# EAGLE design usbtomidi (EAGLE 7.5.0)
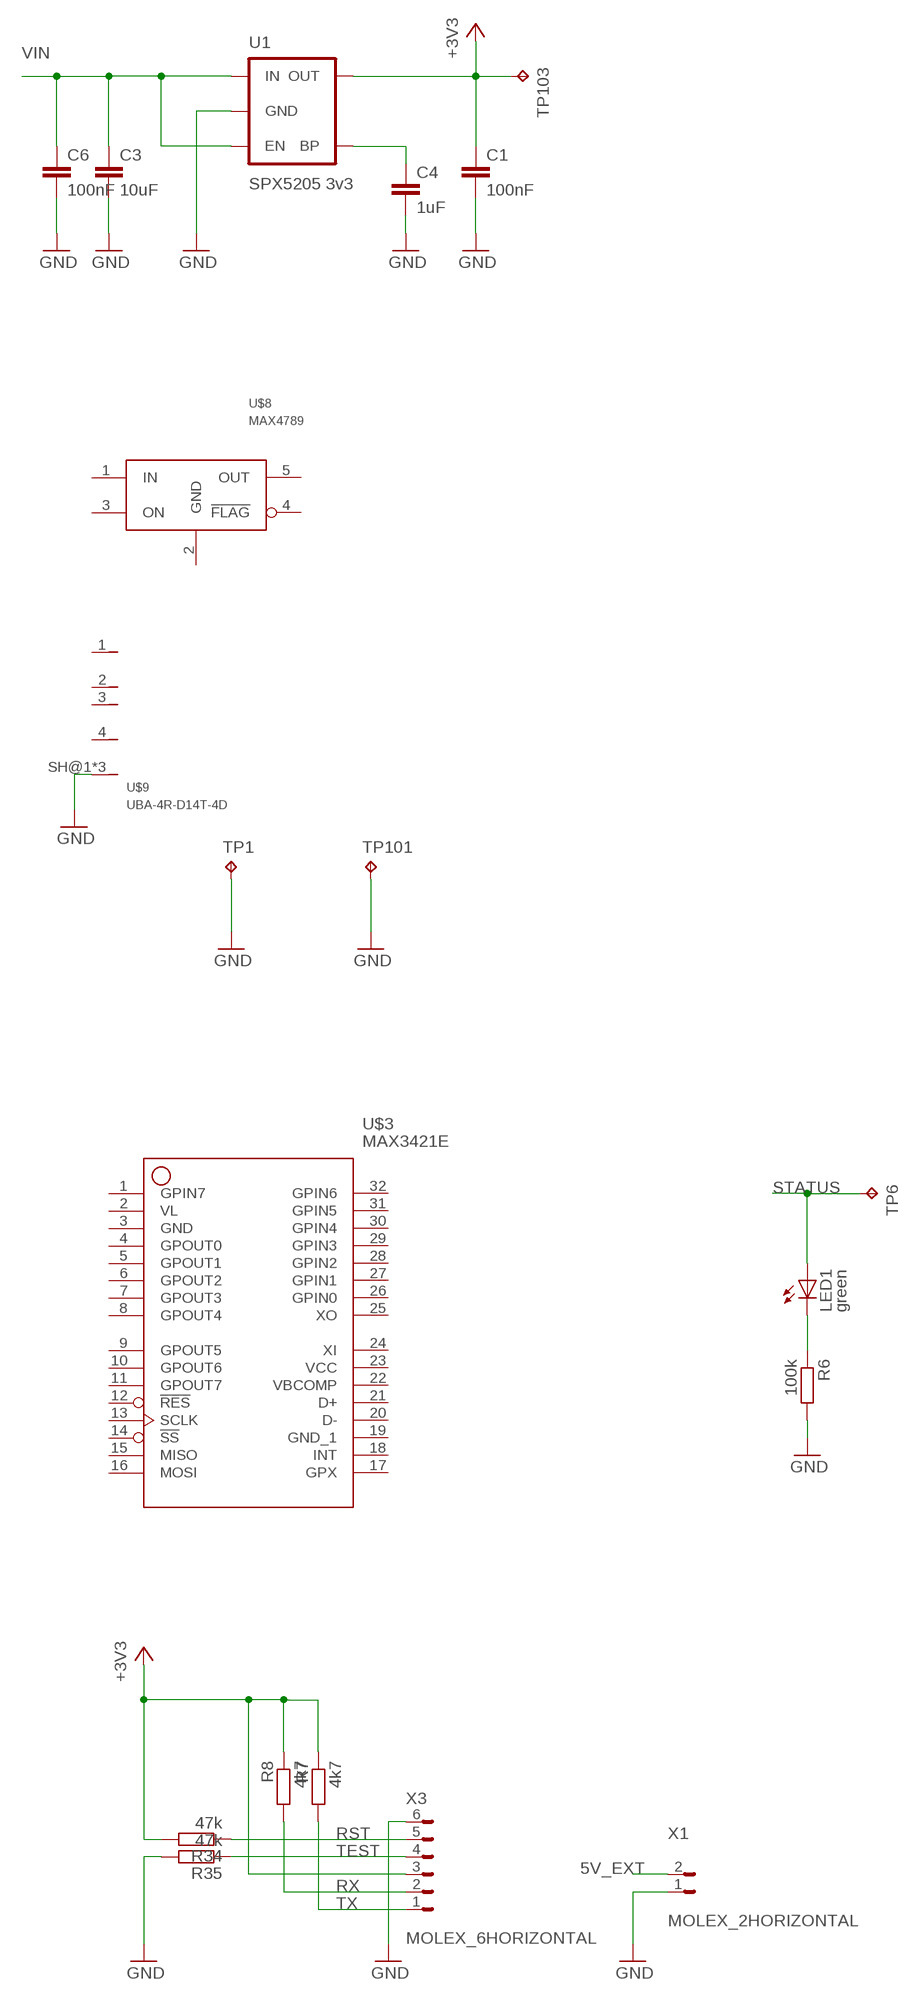
[diagram p0: schematic, sheet 1, part 1 of 2]
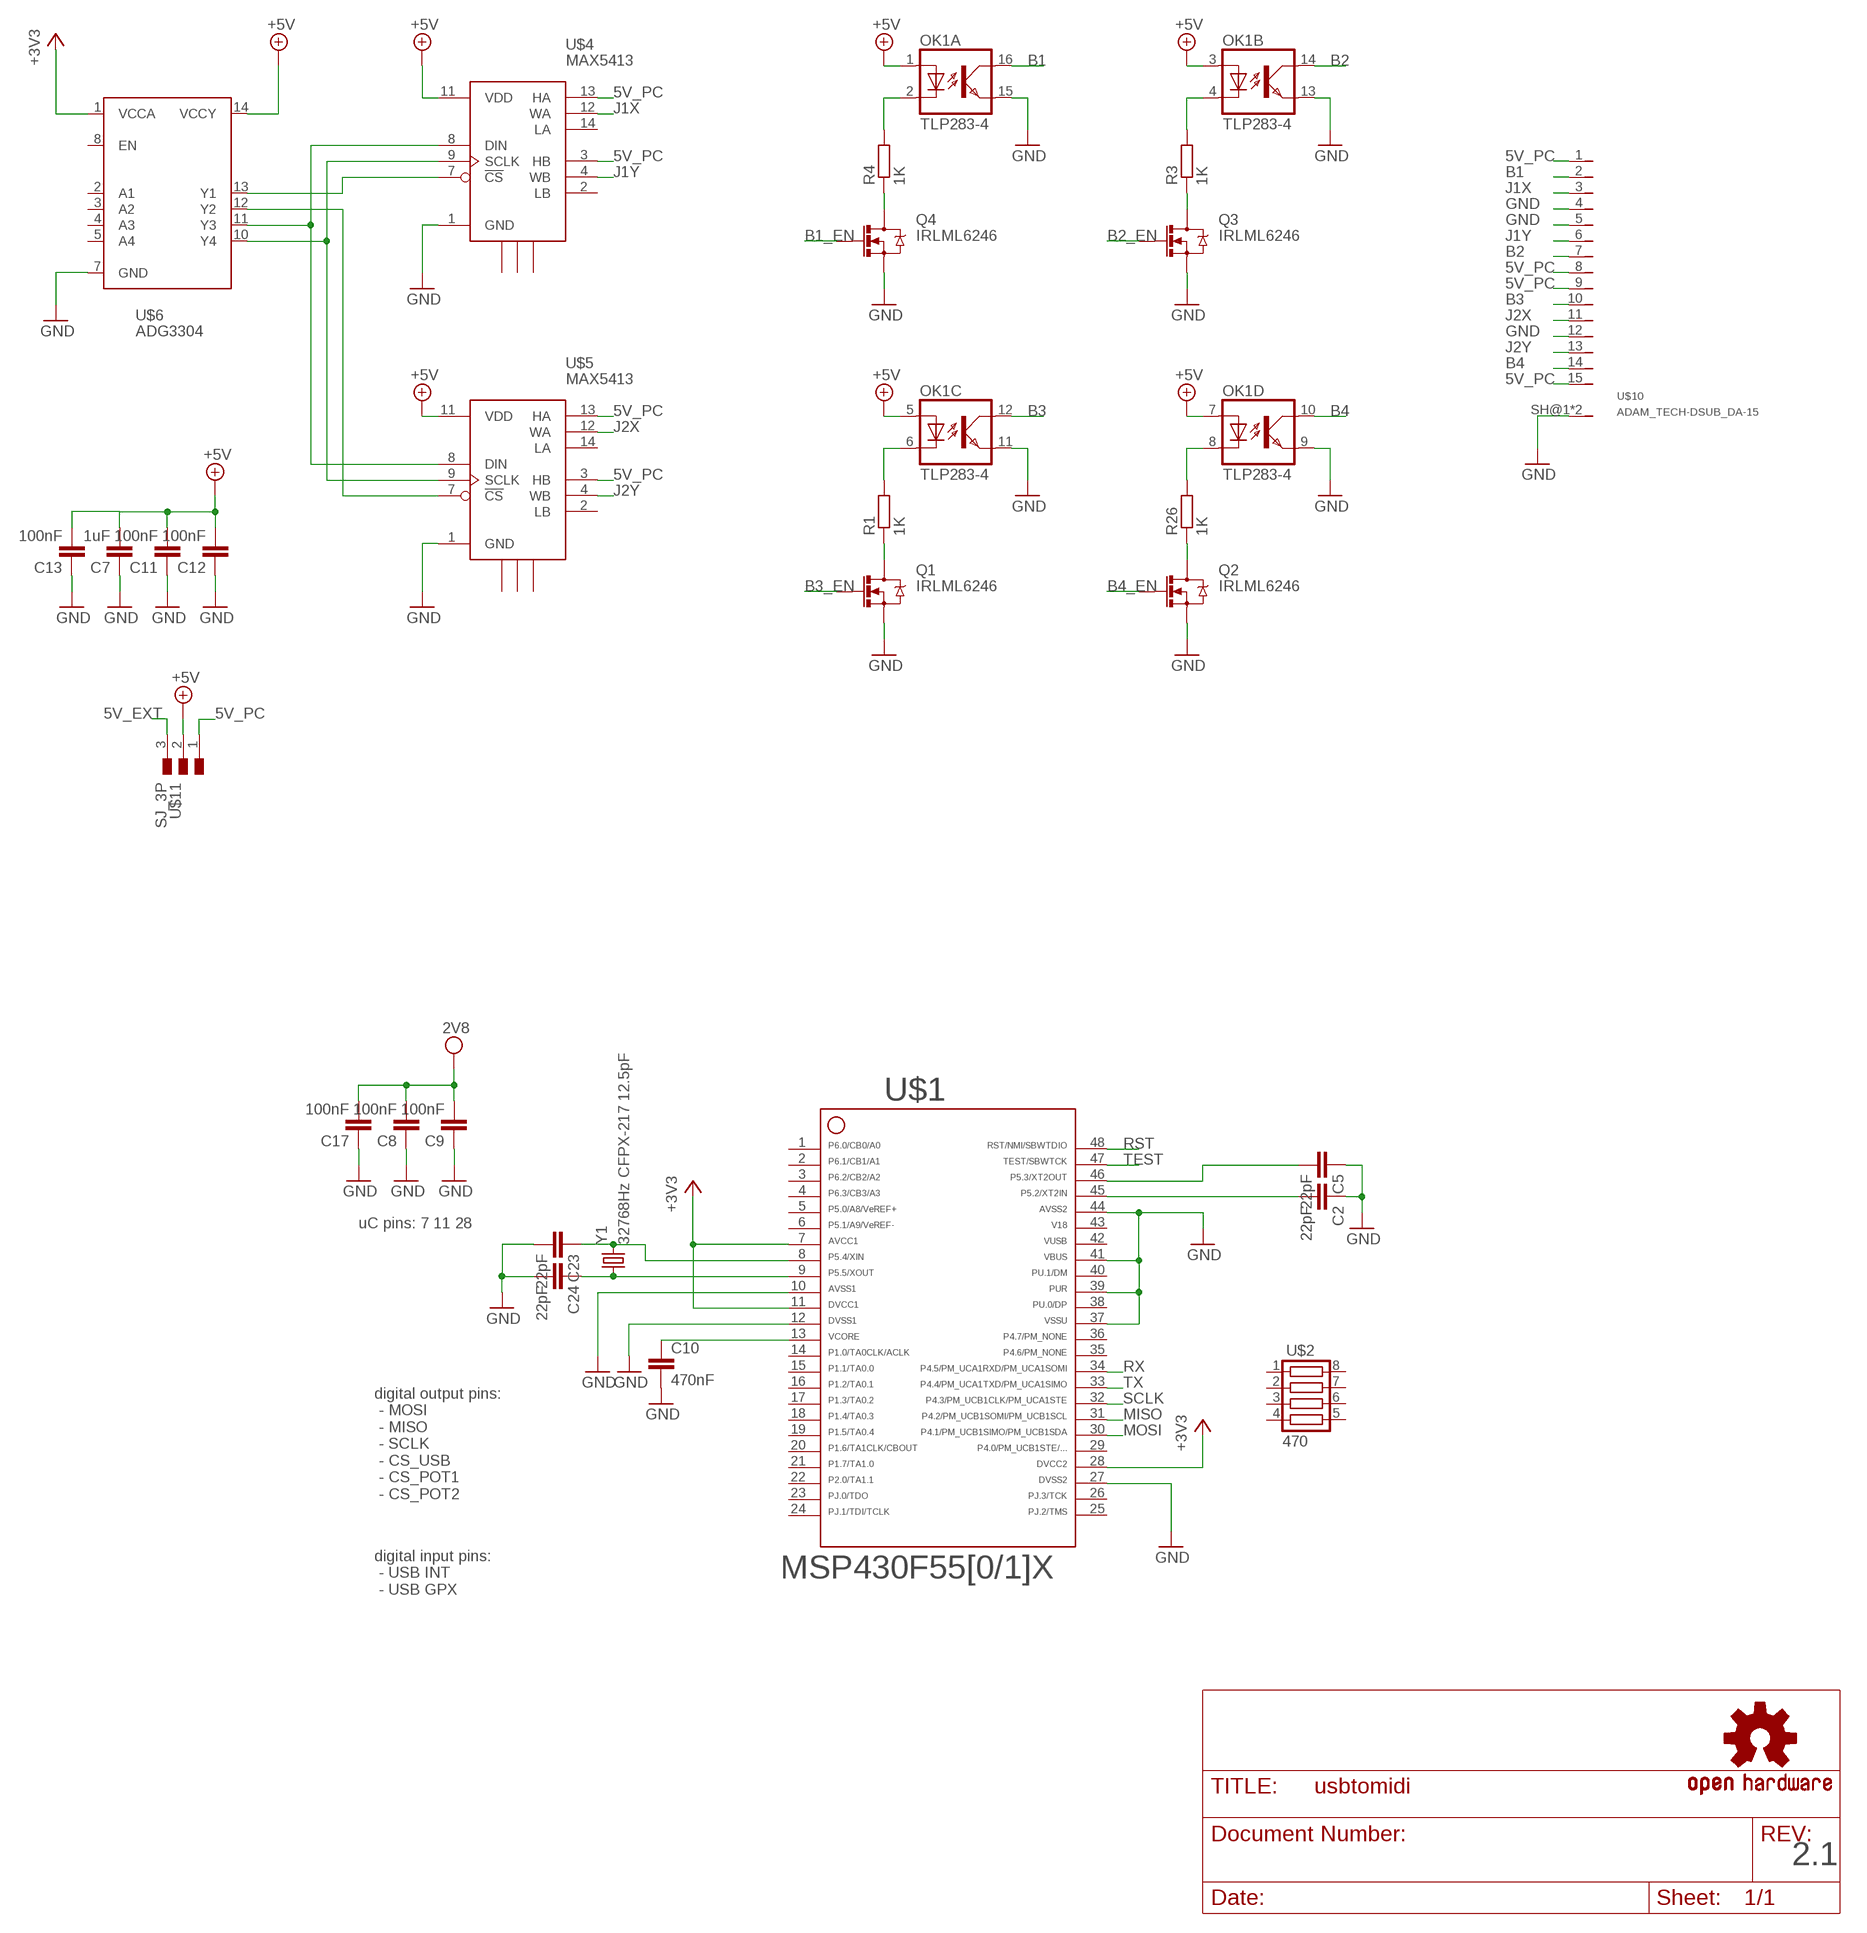
[diagram p1: schematic, sheet 1, part 2 of 2]

## Parts
C1  100nF  C-EUC0805  [C0805]
C2  22pF  C-EUC0805  [C0805]
C3  10uF  C-EUC0805  [C0805]
C4  1uF  C-EUC0805  [C0805]
C5  22pF  C-EUC0805  [C0805]
C6  100nF  C-EUC0805  [C0805]
C7  1uF  C-EUC0805  [C0805]
C8  100nF  C-EUC0805  [C0805]
C9  100nF  C-EUC0805  [C0805]
C10  470nF  C-EUC0805  [C0805]
C11  100nF  C-EUC0805  [C0805]
C12  100nF  C-EUC0805  [C0805]
C13  100nF  C-EUC0805  [C0805]
C17  100nF  C-EUC0805  [C0805]
C23  22pF  C-EUC0805  [C0805]
C24  22pF  C-EUC0805  [C0805]
LED1  green  LEDCHIPLED_0805  [CHIPLED_0805]
OK1  TLP283-4  [MINI-FLAT-16]
Q1  IRLML6246  MOSFET-NCHANNEL_SOT23-3  [SOT23-3]
Q2  IRLML6246  MOSFET-NCHANNEL_SOT23-3  [SOT23-3]
Q3  IRLML6246  MOSFET-NCHANNEL_SOT23-3  [SOT23-3]
Q4  IRLML6246  MOSFET-NCHANNEL_SOT23-3  [SOT23-3]
R1  1K  R-EU_R0805W  [R0805W]
R3  1K  R-EU_R0805W  [R0805W]
R4  1K  R-EU_R0805W  [R0805W]
R6  100k  R-EU_R0805W  [R0805W]
R7  4k7  R-EU_R0805W  [R0805W]
R8  4k7  R-EU_R0805W  [R0805W]
R26  1K  R-EU_R0805W  [R0805W]
R34  47k  R-EU_R0805W  [R0805W]
R35  47k  R-EU_R0805W  [R0805W]
TP1  TPTP12R  [TP12R]
TP6  TPTP12R  [TP12R]
TP101  TPTP12R  [TP12R]
TP103  TPTP12R  [TP12R]
U1  SPX5205 3v3  V_REG_LDOSMD  [SOT23-5]
U$1  MSP430F5510  F55[0/1]X---PT48  [PT48]
U$2  470  RES_ARR  [YC164]
U$3  MAX3421E  [TQFP32]
U$4  MAX5413  [TSSOP14]
U$5  MAX5413  [TSSOP14]
U$6  ADG3304  [TSSOP14]
U$7  OSHW-LOGOM  [OSHW-LOGO-M]
U$8  MAX4789  [SOT23-5]
U$9  UBA-4R-D14T-4D  [UBA-4R-D14T-4D]
U$10  ADAM_TECH-DSUB_DA-15  [ADAM_TECH_D-SUB_15]
U$11  SJ_3P  [SJ_3P]
X1  MOLEX_2HORIZONTAL  [0530480210]
X3  MOLEX_6HORIZONTAL  [0530480610]
Y1  32768Hz CFPX-217 12.5pF  CRYSTAL3.2X1.5  [CRYSTAL-SMD-3.2X1.5]

## Nets
2V8: C8.2 C9.2 C17.2
5V_EXT: U$11.3 X1.2
5V_PC: U$4.3(HB) U$4.13(HA) U$5.3(HB) U$5.13(HA) U$10.1 U$10.8 U$10.9 U$10.15 U$11.1
+3V3: C1.1 R7.1 R8.1 R34.2 TP103.TP U1.5(OUT) U$1.7 U$1.11 U$1.28 U$6.1(VCCA) X3.3
+5V: C7.2 C11.2 C12.2 C13.2 OK1.1(A:A) OK1.3(B:A) OK1.5(C:A) OK1.7(D:A) U$4.11(VDD) U$5.11(VDD) U$6.14(VCCY) U$11.2
B1: OK1.16(A:COL) U$10.2
B1_EN: Q4.1(G)
B2: OK1.14(B:COL) U$10.7
B2_EN: Q3.1(G)
B3: OK1.12(C:COL) U$10.10
B3_EN: Q1.1(G)
B4: OK1.10(D:COL) U$10.14
B4_EN: Q2.1(G)
GND: C1.2 C2.1 C3.2 C4.2 C5.1 C6.2 C7.1 C8.1 C9.1 C10.2 C11.1 C12.1 C13.1 C17.1 C23.2 C24.2 OK1.9(D:EMIT) OK1.11(C:EMIT) OK1.13(B:EMIT) OK1.15(A:EMIT) Q1.2(S) Q2.2(S) Q3.2(S) Q4.2(S) R6.2 R35.2 TP1.TP TP101.TP U1.2(GND) U$1.10 U$1.12 U$1.27 U$1.37 U$1.39 U$1.41 U$1.44 U$4.1(GND) U$5.1(GND) U$6.7(GND) U$9.SH@1(SH) U$9.SH@2(SH) U$9.SH@3(SH) U$10.4 U$10.5 U$10.12 U$10.SH@1(SHIELD) U$10.SH@2(SHIELD) X1.1 X3.6
HIGH_CS1: U$4.7(!CS) U$6.13(Y1)
HIGH_CS2: U$5.7(!CS) U$6.12(Y2)
HIGH_MOSI: U$4.8(DIN) U$5.8(DIN) U$6.11(Y3)
HIGH_SCLK: U$4.9(SCLK) U$5.9(SCLK) U$6.10(Y4)
J1X: U$4.12(WA) U$10.3
J1Y: U$4.4(WB) U$10.6
J2X: U$5.12(WA) U$10.11
J2Y: U$5.4(WB) U$10.13
MISO: U$1.31
MOSI: U$1.30
N$1: C2.2 U$1.45
N$2: C4.1 U1.4(BP)
N$3: C5.2 U$1.46
N$5: Q1.3(D) R1.1
N$6: C10.1 U$1.13
N$7: OK1.6(C:C) R1.2
N$8: LED1.C R6.1
N$9: OK1.8(D:C) R26.2
N$12: Q3.3(D) R3.1
N$13: OK1.4(B:C) R3.2
N$14: Q4.3(D) R4.1
N$15: OK1.2(A:C) R4.2
N$22: Q2.3(D) R26.1
N$25: C24.1 U$1.9 Y1.P$1
N$26: C23.1 U$1.8 Y1.P$2
RST: R34.1 U$1.48 X3.5
RX: R8.2 U$1.34 X3.2
SCLK: U$1.32
STATUS: LED1.A TP6.TP
TEST: R35.1 U$1.47 X3.4
TX: R7.2 U$1.33 X3.1
VIN: C3.1 C6.1 U1.1(IN) U1.3(EN)
Unconnected: U$1.1 U$1.2 U$1.3 U$1.4 U$1.5 U$1.6 U$1.14 U$1.15 U$1.16 U$1.17 U$1.18 U$1.19 U$1.20 U$1.21 U$1.22 U$1.23 U$1.24 U$1.25 U$1.26 U$1.29 U$1.35 U$1.36 U$1.38 U$1.40 U$2.1 U$2.2 U$2.3 U$2.4 U$2.5 U$2.6 U$2.7 U$2.8 U$3.1(GPIN7) U$3.2(VL) U$3.3(GND) U$3.4(GPOUT0) U$3.5(GPOUT1) U$3.6(GPOUT2) U$3.7(GPOUT3) U$3.8(GPOUT4) U$3.9(GPOUT5) U$3.10(GPOUT6) U$3.11(GPOUT7) U$3.12(!RES) U$3.13(SCLK) U$3.14(!SS) U$3.15(MISO) U$3.16(MOSI) U$3.17(GPX) U$3.18(INT) U$3.19(GND_1) U$3.20(D-) U$3.21(D+) U$3.22(VBCOMP) U$3.23(VCC) U$3.24(XI) U$3.25(XO) U$3.26(GPIN0) U$3.27(GPIN1) U$3.28(GPIN2) U$3.29(GPIN3) U$3.30(GPIN4) U$3.31(GPIN5) U$3.32(GPIN6) U$4.2(LB) U$4.5(NC1) U$4.6(NC2) U$4.10(NC3) U$4.14(LA) U$5.2(LB) U$5.5(NC1) U$5.6(NC2) U$5.10(NC3) U$5.14(LA) U$6.2(A1) U$6.3(A2) U$6.4(A3) U$6.5(A4) U$6.8(EN) U$8.2(GND) U$8.3(ON) U$8.4(!FLAG) U$9.1 U$9.2 U$9.3 U$9.4

## Notes on the sheet
- uC pins: 7 11 28
- digital output pins: 
   - MOSI
   - MISO
   - SCLK
   - CS_USB
   - CS_POT1
   - CS_POT2
- digital input pins:
   - USB INT
   - USB GPX
- 2.1

## Power pins joined to a net without a drawn wire
42: U$1.42
43: U$1.43
IN: U$8.1(IN)
OUT: U$8.5(OUT)

## Library data of the parts
C1-C13 C17 C23 C24 = rcl:C-EU: CAPACITOR, European symbol
LED1 = led:LED: LED OSRAM: - CHIPLED LG R971, LG N971, LY N971, LG Q971, LY Q971, LO R971, LY R971 LH N974, LH R974 LS Q976, LO Q976, LY Q976 LO Q996 - Hyper CHIPLED LW Q18S LB Q993, LB Q99A, LB R99A - SideLED LS A670, LO A670, LY A670, LG A670, LP A670 LB A673, LV A673, LT A673, LW A673 LH A674 LY A675 LS A676, LA A676, LO A676, LY A676, LW A676 LS A679, LY A679, LG A679 - Hyper Micro SIDELED® LS Y876, LA Y876, LO Y876, LY Y876 LT Y87S - SmartLED LW L88C, LW L88S LB L89C, LB L89S, LG L890 LS L89K, LO L89K, LY L89K LS L896, LA L896, LO L896, LY L896 - TOPLED LS T670, LO T670, LY T670, LG T670, LP T670 LSG T670, LSP T670, LSY T670, LOP T670, LYG T670 LG T671, LOG T671, LSG T671 LB T673, LV T673, LT T673, LW T673 LH T674 LS T676, LA T676, LO T676, LY T676, LB T676, LH T676, LSB T676, LW T676 LB T67C, LV T67C, LT T67C, LS T67K, LO T67K, LY T67K, LW E67C LS E67B, LA E67B, LO E67B, LY E67B, LB E67C, LV E67C, LT E67C LW T67C LS T679, LY T679, LG T679 LS T770, LO T770, LY T770, LG T770, LP T770 LB T773, LV T773, LT T773, LW T773 LH T774 LS E675, LA E675, LY E675, LS T675 LS T776, LA T776, LO T776, LY T776, LB T776 LHGB T686 LT T68C, LB T68C - Hyper Mini TOPLED® LB M676 - Mini TOPLED Santana® LG M470 LS M47K, LO M47K, LY M47K Source: http://www.osram.convergy.de LUXEON: - LUMILED® LXK2-PW12-R00, LXK2-PW12-S00, LXK2-PW14-U00, LXK2-PW14-V00 LXK2-PM12-R00, LXK2-PM12-S00, LXK2-PM14-U00 LXK2-PE12-Q00, LXK2-PE12-R00, LXK2-PE12-S00, LXK2-PE14-T00, LXK2-PE14-U00 LXK2-PB12-K00, LXK2-PB12-L00, LXK2-PB12-M00, LXK2-PB14-N00, LXK2-PB14-P00, LXK2-PB14-Q00 LXK2-PR12-L00, LXK2-PR12-M00, LXK2-PR14-Q00, LXK2-PR14-R00 LXK2-PD12-Q00, LXK2-PD12-R00, LXK2-PD12-S00 LXK2-PH12-R00, LXK2-PH12-S00 LXK2-PL12-P00, LXK2-PL12-Q00, LXK2-PL12-R00 Source: www.luxeon.com KINGBRIGHT: KA-3528ASYC Source: www.kingbright.com
OK1 = optocoupler:TLP283-4: TOSHIBA PHOTOCOUPLER GaAs IRED & PHOTO-TRANSISTOR Source: http://www.semicon.toshiba.co.jp/td/en/Opto/Photocoupler/en_20050928_TLP283_datasheet.pdf; OC_FARNELL: unknown; OC_NEWARK: unknown
Q1-Q4 = Simplex-DiscreteSemi:MOSFET-NCHANNEL: Generic N-channel mosfet
R1 R3 R4 R6-R8 R26 R34 R35 = rcl:R-EU_: RESISTOR, European symbol
TP1 TP6 TP101 TP103 = testpad:TP: Test pad
U1 = SparkFun:V_REG_LDO: Voltage Regulator LDO Standard 150mA LDO voltage regulator in SOT-23 layout. Micrel part MIC5205. BP (by-pass) pin is used to lower output noise with 470pF cap.
U$1 = TI_MSP430_v16:F55[0/1]X---PT48: ***F55[0/1/2]X*** PT48 Rev. 1.0 06/2010 "http://www.ti.com/lit/gpn/msp430f5509" Only for FF5504, F5508,F5509,F5510
U$2 = Simplex-rlc:RES_ARR: resistor chip array yageo YC164 series (8pin/4R)
U$3 = Simplex-ICs:MAX3421E: MAX3421E USB Periperal/Host Controller
U$4 U$5 = Simplex-ICs:MAX5413: MAX5413 / MAX5414 / MAX 5415 dual digital potentiometers
U$6 = Simplex-ICs:ADG3304: ADG3304 4channel bi-directional voltage level translator
U$7 = SparkFun:OSHW-LOGO: Open Source Hardware Logo This logo indicates the piece of hardware it is found on incorporates a OSHW license and/or adheres to the definition of open source hardware found here: http://freedomdefined.org/OSHW
U$8 = Simplex-ICs:MAX4789: MAX4789 - MAX4794 current limit switch
U$9 = Simplex-Connectors:UBA-4R-D14T-4D: JST USB A
U$10 = Simplex-Connectors:ADAM_TECH-DSUB_DA-15: ADAM TECH D-SUB DA-15
U$11 = Simplex-Jumpers:SJ_3P: solder jumper 3 pin
X1 = Simplex-Connectors:MOLEX_2: Molex 2 pin connectors 1.25mm PicoBlade
X3 = Simplex-Connectors:MOLEX_6: Molex 6 pin connectors 1.25mm PicoBlade
Y1 = Simplex-FreqCtrl:CRYSTAL: smd crystals

## Net classes
1 vcc: width 0.203 mm

## Board
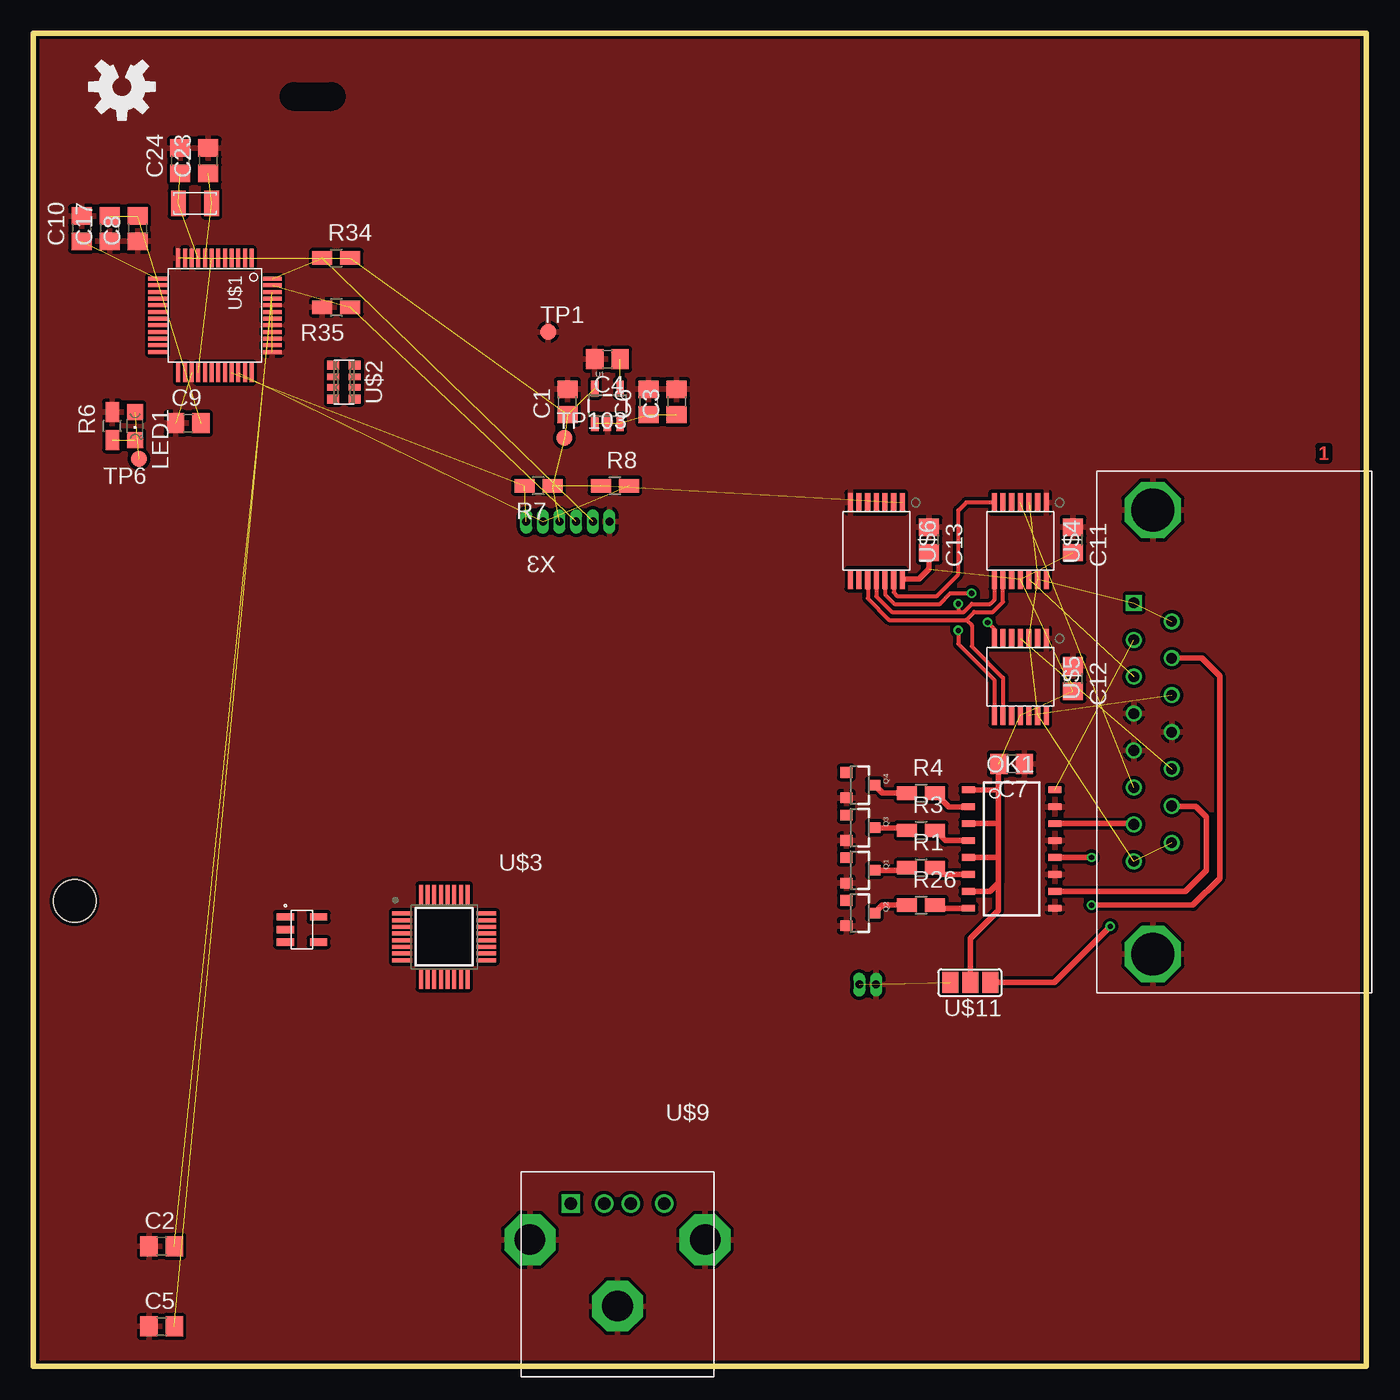
[diagram p2: board, top side]
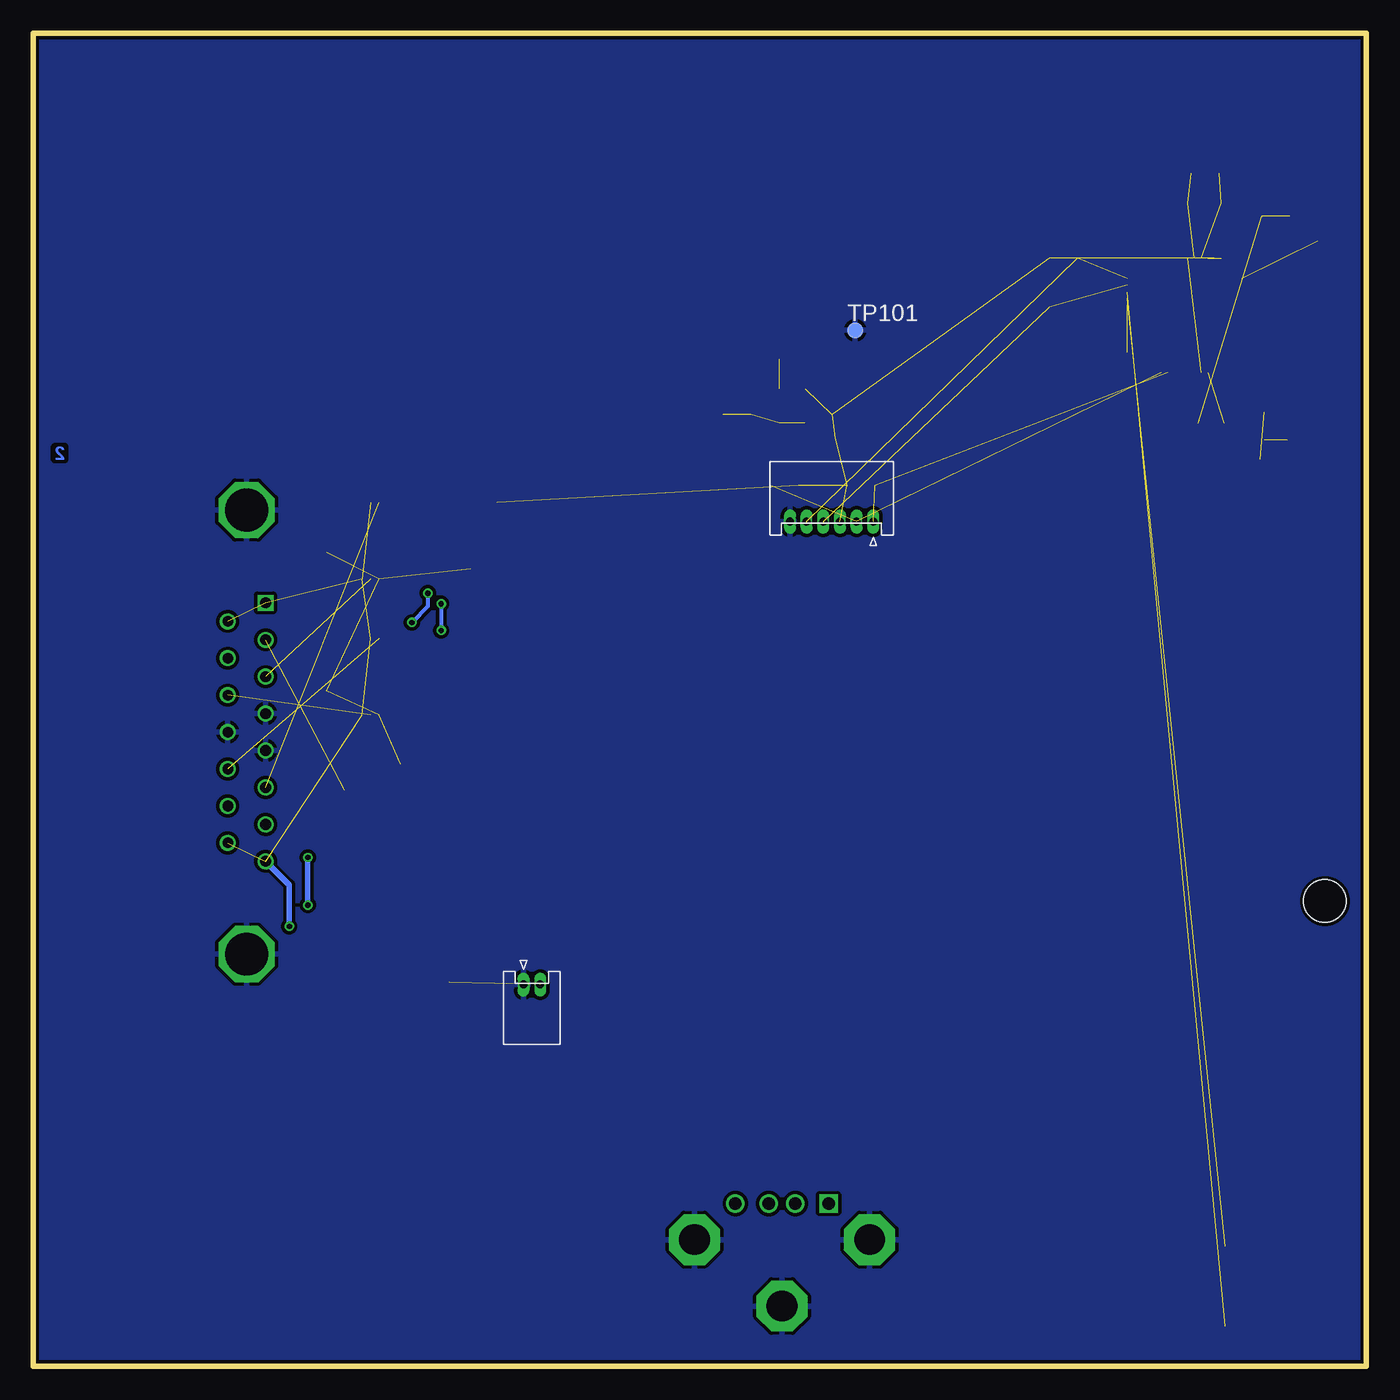
[diagram p3: board, bottom side, seen from below]

Size 100 x 100 mm. Coordinates in mm from the lower left corner, seen from the top.
Outline: 0,0 100,0 100,100 0,100 0,0
Copper layers (1*16): Top 0.035mm / dielectric 1.5mm / Bottom 0.035mm
Design rules "seeedstudio_rules_v1.1 *": minimum track width 6mil, minimum drill 12mil, track to track 6mil, track to pad 6mil, pad to pad 6mil, via to via 6mil, smd to smd 0mil, copper to edge 10mil, drill to drill 10mil, minimum pad ring 0.154mm, minimum via ring 6mil, stop-mask expansion 2mil, vias tented up to drill 100mil, thermal gap 10mil
Holes 3.2 mm at 3.1,34.9
tRestrict: 1 lines

### Footprints (pad centres in the part's own frame; a part is rotated, then mirrored left to right if it is on the bottom)
C0805 = smd 1.3 x 1.5: 1 -0.95,0; 2 0.95,0
CHIPLED_0805 = smd 1.2 x 1.2: A 0,-1.05; C 0,1.05
MINI-FLAT-16 = smd 1 x 0.5: 1 -3.24,4.445; 2 -3.24,3.175; 3 -3.24,1.905; 4 -3.24,0.635; 5 -3.24,-0.635; 6 -3.24,-1.905; 7 -3.24,-3.175; 8 -3.24,-4.445; 9 3.24,-4.445; 10 3.24,-3.175; 11 3.24,-1.905; 12 3.24,-0.635; 13 3.24,0.635; 14 3.24,1.905; 15 3.24,3.175; 16 3.24,4.445
SOT23-3 = smd 0.8 x 0.9: 1 -0.95,-1; 2 0.95,-1; 3 0,1.1
R0805W = smd 1.5 x 1: 1 -1.052,0; 2 1.052,0
TP12R = smd 1.2 x 1.2: TP 0,0
SOT23-5 = smd 0.55 x 1.2: 1 -0.95,-1.3; 2 0,-1.3; 3 0.95,-1.3; 4 0.95,1.3; 5 -0.95,1.3
PT48 = smd 1.4 x 0.3: 1 -4.3,2.75; 2 -4.3,2.25; 3 -4.3,1.75; 4 -4.3,1.25; 5 -4.3,0.75; 6 -4.3,0.25; 7 -4.3,-0.25; 8 -4.3,-0.75; 9 -4.3,-1.25; 10 -4.3,-1.75; 11 -4.3,-2.25; 12 -4.3,-2.75; 25 4.3,-2.75; 26 4.3,-2.25; 27 4.3,-1.75; 28 4.3,-1.25; 29 4.3,-0.75; 30 4.3,-0.25; 31 4.3,0.25; 32 4.3,0.75; 33 4.3,1.25; 34 4.3,1.75; 35 4.3,2.25; 36 4.3,2.75 | smd 0.3 x 1.4: 13 -2.75,-4.3; 14 -2.25,-4.3; 15 -1.75,-4.3; 16 -1.25,-4.3; 17 -0.75,-4.3; 18 -0.25,-4.3; 19 0.25,-4.3; 20 0.75,-4.3; 21 1.25,-4.3; 22 1.75,-4.3; 23 2.25,-4.3; 24 2.75,-4.3; 37 2.75,4.3; 38 2.25,4.3; 39 1.75,4.3; 40 1.25,4.3; 41 0.75,4.3; 42 0.25,4.3; 43 -0.25,4.3; 44 -0.75,4.3; 45 -1.25,4.3; 46 -1.75,4.3; 47 -2.25,4.3; 48 -2.75,4.3
YC164 = smd 0.65 x 0.9: 1 -1.275,-0.8; 4 1.275,-0.8; 5 1.275,0.8; 8 -1.275,0.8 | smd 0.5 x 0.9: 2 -0.4,-0.8; 3 0.4,-0.8; 6 0.4,0.8; 7 -0.4,0.8
TQFP32 = smd 1.475 x 0.3: 1 0,0; 2 0,-0.5; 3 0,-1; 4 0,-1.5; 5 0,-2; 6 0,-2.5; 7 0,-3; 8 0,-3.5; 17 6.32,-3.5; 18 6.32,-3; 19 6.32,-2.5; 20 6.32,-2; 21 6.32,-1.5; 22 6.32,-1; 23 6.32,-0.5; 24 6.32,0 | smd 0.3 x 1.475: 9 1.41,-4.91; 10 1.91,-4.91; 11 2.41,-4.91; 12 2.91,-4.91; 13 3.41,-4.91; 14 3.91,-4.91; 15 4.41,-4.91; 16 4.91,-4.91; 25 4.91,1.41; 26 4.41,1.41; 27 3.91,1.41; 28 3.41,1.41; 29 2.91,1.41; 30 2.41,1.41; 31 1.91,1.41; 32 1.41,1.41
TSSOP14 = smd 1.45 x 0.38: 1 0,0; 2 0,-0.65; 3 0,-1.3; 4 0,-1.95; 5 0,-2.6; 6 0,-3.25; 7 0,-3.9; 8 5.75,-3.9; 9 5.75,-3.25; 10 5.75,-2.6; 11 5.75,-1.95; 12 5.75,-1.3; 13 5.75,-0.65; 14 5.75,0
SOT23-5' = smd 1.3 x 0.55: 1 0,0; 2 0,-0.95; 3 0,-1.9; 4 2.5,-1.9; 5 2.5,0
UBA-4R-D14T-4D = drill 0.92 square: 1 3.07,2.71 | drill 0.92: 2 5.57,2.71; 3 7.57,2.71; 4 10.07,2.71 | drill 2.3 pad 3.81 octagon: SH@1 0,0; SH@2 6.57,-4.98; SH@3 13.14,0
ADAM_TECH_D-SUB_15 = drill 0.8 square: 1 19.39,0 | drill 0.8: 2 16.62,0; 3 13.85,0; 4 11.08,0; 5 8.31,0; 6 5.54,0; 7 2.77,0; 8 0,0; 9 18.005,-2.84; 10 15.235,-2.84; 11 12.465,-2.84; 12 9.695,-2.84; 13 6.925,-2.84; 14 4.155,-2.84; 15 1.385,-2.84 | drill 3.2 octagon: SH@1 -6.965,-1.42; SH@2 26.355,-1.42
SJ_3P = smd 1.2 x 1.6: 1 0,0; 2 1.5,0; 3 3,0
0530480210 = drill 0.6 pad 0.9 long: 1 0,0; 2 1.25,0
0530480610 = drill 0.6 pad 0.9 long: 1 0,0; 2 1.25,0; 3 2.5,0; 4 3.75,0; 5 5,0; 6 6.25,0
CRYSTAL-SMD-3.2X1.5 = smd 1.1 x 1.9: P$1 -1.25,0; P$2 1.25,0

### Placement (x,y rotation side)
C1  40.07,72.35 90 top
C2  9.63,9 0 top
C3  48.27,72.35 90 top
C4  43.07,75.55 180 top
C5  9.63,2.98 0 top
C6  46.17,72.35 90 top
C7  73.4,45.2 180 top
C8  7.83,85.34 90 top
C9  11.63,70.74 0 top
C10  3.63,85.34 90 top
C11  78,62 270 top
C12  78,51.6 270 top
C13  67.2,62 270 top
C17  5.73,85.34 90 top
C23  13.13,90.44 90 top
C24  11.03,90.44 90 top
LED1  7.63,70.54 180 top
OK1  73.4,38.8 0 top
Q1  62,37.2 270 top
Q2  62,34 270 top
Q3  62,40.4 270 top
Q4  62,43.6 270 top
R1  66.6,37.4 0 top
R3  66.6,40.2 0 top
R4  66.6,43 0 top
R6  5.93,70.54 90 top
R7  37.9,66.06 180 top
R8  43.63,66.06 0 top
R26  66.6,34.6 0 top
R34  22.73,83.14 0 top
R35  22.73,79.44 180 top
TP1  38.63,77.59 0 top
TP6  7.93,68.07 180 top
TP101  38.34,77.73 0 bottom
TP103  39.84,69.64 0 top
U1  43.07,72.05 0 top
U$1  13.63,78.84 270 top
U$2  23.31,73.83 270 top
U$3  27.67,33.96 0 top
U$4  76,64.8 270 top
U$5  76,54.6 270 top
U$6  65.2,64.8 270 top
U$7  6.65,95.99 180 top
U$8  MAX4789  [SOT23-5']  18.9,33.71 0 top
U$9  37.26,9.49 0 top
U$10  82.57,37.88 90 top
U$11  71.8,28.8 180 top
X1  63.22,28.63 0 bottom
X3  36.98,63.37 180 bottom
Y1  12.13,87.24 0 top

### Tracks (layer width: path | path; a pad name or v marks a point on that pad's centre or on a via)
2V8  (2 unrouted)
5V_EXT  (1 unrouted)
5V_PC  (via drill 0.4)  (7 unrouted)
  Top 0.406: v80.8,33 76.6,28.8 U$11.1
  Bottom 0.406: U$10.8 80.8,36.11 v80.8,33
+3V3  (10 unrouted)
+5V  (5 unrouted)
  Top 0.406: OK1.7 71.78,35.62 72.4,36.25 | OK1.5 72.4,38.16 | OK1.3 72.4,40.7 | 72.4,40.7 72.4,38.16 | 72.4,38.16 72.4,36.25 | OK1.1 72.4,43.24 | 72.4,43.24 72.4,40.7 | 72.4,43.24 72.4,45.2 C7.2 | U$11.2 70.3,32.1 72.4,34.2 72.4,36.25 | U$6.14 66.45,59.05 67.2,59.8 C13.2
B1  (1 unrouted)
B2
  Top 0.406: OK1.14 82.52,40.7 U$10.7
B3  (via drill 0.4)
  Top 0.406: U$10.10 87.69,53.12 89,51.8 89,36.6 87,34.6 v79.4,34.6 | OK1.12 v79.4,38.16 79.4,38.2
  Bottom 0.406: v79.4,38.16 v79.4,34.6
B4
  Top 0.406: OK1.10 86.42,35.62 88,37.2 88,41.2 87.2,42 85.44,42 U$10.14
GND  (5 unrouted)
  pour Top (isolate 0.254): 0,100 100,100 100,0 0,0
  pour Bottom (isolate 0.254): 0,100 100,100 100,0 0,0
HIGH_CS1
  Top 0.305: U$6.13 64.55,58.05 64.8,57.8 67.8,57.8 69.4,59.4 69.4,64.2 70,64.8 U$4.7
HIGH_CS2  (via drill 0.4)
  Top 0.305: U$6.12 63.9,57.9 64.6,57.2 68,57.2 68.8,58 v70.4,58 | U$5.7 72.1,55.3 v71.6,55.8
  Bottom 0.305: v70.4,58 70.4,57 v71.6,55.8
HIGH_MOSI  (via drill 0.4)
  Top 0.305: U$4.8 72.1,57.5 71.8,57.2 70.4,57.2 69.8,56.6 69.4,56.6 | U$6.11 63.25,57.75 64.4,56.6 69.4,56.6 | v69.4,57.2 69.4,56.6 | v69.4,55.2 69.4,54.2 72.1,51.5 U$5.8
  Bottom 0.305: v69.4,57.2 v69.4,55.2
HIGH_SCLK
  Top 0.305: U$6.10 62.6,57.6 64.2,56 70,56 | U$4.9 72.75,57.35 72,56.6 70.6,56.6 70,56 | 70,56 70.4,55.6 70.4,54 72.75,51.65 U$5.9
J1X  (1 unrouted)
J1Y  (1 unrouted)
J2X  (1 unrouted)
J2Y  (1 unrouted)
N$1  (1 unrouted)
N$2  (1 unrouted)
N$3  (1 unrouted)
N$5
  Top 0.406: R1.1 65.35,37.2 Q1.3
N$6  (1 unrouted)
N$7
  Top 0.406: OK1.6 68.16,36.9 R1.2
N$8  (1 unrouted)
N$9
  Top 0.406: OK1.8 67.9,34.35 R26.2
N$12
  Top 0.406: R3.1 65.35,40.4 Q3.3
N$13
  Top 0.406: OK1.4 68.42,39.44 R3.2
N$14
  Top 0.406: Q4.3 63.7,43 R4.1
N$15
  Top 0.406: OK1.2 68.68,41.98 R4.2
N$22
  Top 0.406: R26.1 63.7,34.6 Q2.3
N$25  (2 unrouted)
N$26  (2 unrouted)
RST  (2 unrouted)
RX  (2 unrouted)
STATUS  (1 unrouted)
TEST  (2 unrouted)
TX  (2 unrouted)
VIN  (3 unrouted)

### Text on the board
Top: 1
Bottom: 2
tmine: debug | 5V
bmine: tp5 | tp4 | tp3 | tp6 | tp2 | tp1 | status | +3V3 | Petre Rodan 201812 rev1 | github.com/rodan/retrojoy